# Altium project RodManipulator_PRJ.PrjPcb
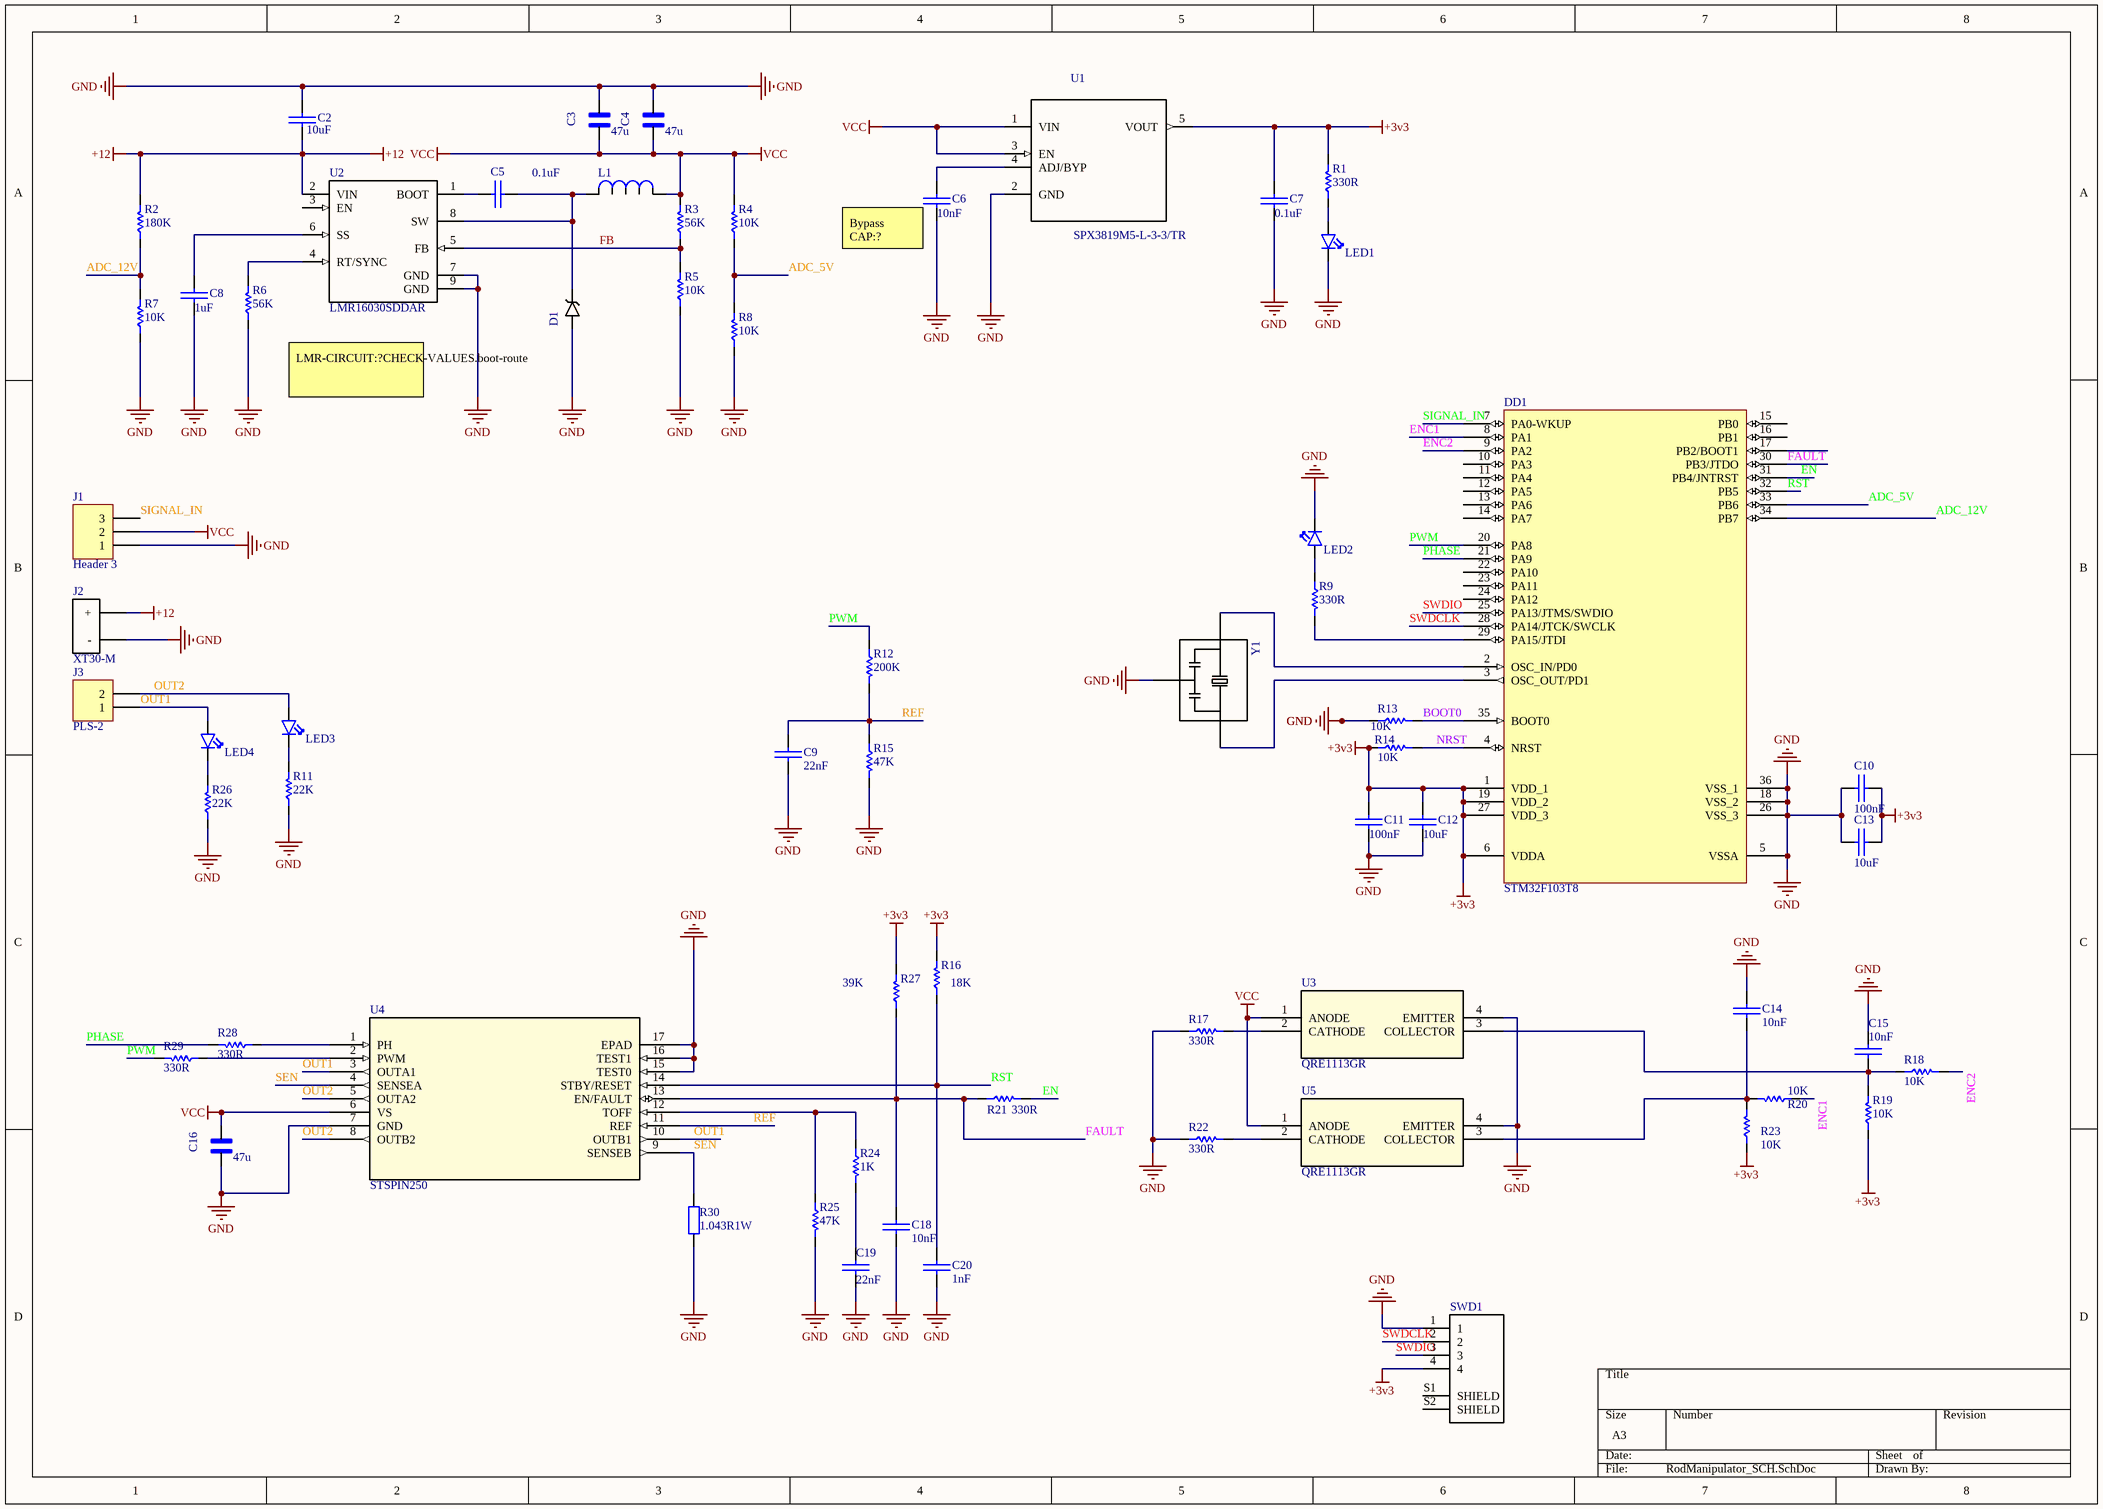
[diagram p0: RodManipulator_SCH.SchDoc]
1 sheet, 64 parts. Net scope: global (net labels, ports and power ports of the same name join across sheets).
Board file: RodManipulator_PCB.PcbDoc

## Sheet RodManipulator_SCH.SchDoc
size A3

### Parts
C2  10uF  [SMD_CAP_0603]
C3  value 47u  [*CAPC3216X125N]  (hidden comment: GRM31CR61A476KE15L)
C4  value 47u  [*CAPC3216X125N]  (hidden comment: GRM31CR61A476KE15L)
C5  0.1uF  [SMD_CAP_0603]
C6  10nF  [SMD_CAP_0603]
C7  0.1uF  [SMD_CAP_0603]
C8  1uF  [SMD_CAP_0603]
C9  22nF  [SMD_CAP_0603]
C10  100nF  [SMD_CAP_0603]
C11  100nF  [SMD_CAP_0603]
C12  10uF  [SMD_CAP_0603]
C13  10uF  [SMD_CAP_0603]
C14  10nF  [SMD_CAP_0603]
C15  10nF  [SMD_CAP_0603]
C16  value 47u  [*CAPC3216X125N]  (hidden comment: GRM31CR61A476KE15L)
C18  10nF  [SMD_CAP_0603]
C19  22nF  [SMD_CAP_0603]
C20  1nF  [SMD_CAP_0603]
D1  SK56  [*SMB_P6SMB62AT3G(Primary)]  (value not drawn)
DD1  STM32F103T8  [*QFN50P600X600X100-37N]
J1  Header 3  [HDR Side 3 pin]
J2  XT30-M  [XT30-M side]
J3  PLS-2  [HDR Side 2 pin]
L1  IHLP2020BZER100M01  [IHLP]  (value not drawn)
LED1  LED  [LED0603]  (value not drawn)
LED2  LED  [LED0603]  (value not drawn)
LED3  LED  [LED0603]  (value not drawn)
LED4  LED  [LED0603]  (value not drawn)
R1  330R  [RES 0603 (1608X06L)]
R2  180K  [RES 0603 (1608X06L)]
R3  56K  [RES 0603 (1608X06L)]
R4  10K  [RES 0603 (1608X06L)]
R5  10K  [RES 0603 (1608X06L)]
R6  56K  [RES 0603 (1608X06L)]
R7  10K  [RES 0603 (1608X06L)]
R8  10K  [RES 0603 (1608X06L)]
R9  330R  [RES 0603 (1608X06L)]
R11  22K  [RES 0603 (1608X06L)]
R12  200K  [RES 0603 (1608X06L)]
R13  10K  [RES 0603 (1608X06L)]
R14  10K  [RES 0603 (1608X06L)]
R15  47K  [RES 0603 (1608X06L)]
R16  18K  [RES 0603 (1608X06L)]
R17  330R  [RES 0603 (1608X06L)]
R18  10K  [RES 0603 (1608X06L)]
R19  10K  [RES 0603 (1608X06L)]
R20  10K  [RES 0603 (1608X06L)]
R21  330R  [RES 0603 (1608X06L)]
R22  330R  [RES 0603 (1608X06L)]
R23  10K  [RES 0603 (1608X06L)]
R24  1K  [RES 0603 (1608X06L)]
R25  47K  [RES 0603 (1608X06L)]
R26  22K  [RES 0603 (1608X06L)]
R27  39K  [RES 0603 (1608X06L)]
R28  330R  [RES 0603 (1608X06L)]
R29  330R  [RES 0603 (1608X06L)]
R30  value 1.043R1W  [RES2512]  (hidden comment: resistor)
SWD1  SM04B-GHS-TB(LF)(SN)-  [JST_BM04B-GHS-holes]  (value not drawn)
U1  SPX3819M5-L-3-3/TR  [*SOT95P280X145-5N]
U2  LMR16030SDDAR  [*SOIC127P600X170-9N - duplicate]
U3  QRE1113GR  [SMD4_2P90X3P60_ONS]
U4  STSPIN250  [VFQFPN-16]
U5  QRE1113GR  [SMD4_2P90X3P60_ONS]
Y1  CSTCE8M00G55-R0  [*OSC_CSTCE8M00G55-R0]  (value not drawn)

### Nets
+3v3: C7.2(-) C10.1(+) C11.1(+) C12.1(+) C13.1(+) DD1.1(VDD_1) DD1.6(VDDA) DD1.19(VDD_2) DD1.27(VDD_3) R1.2 R14.1 R16.2 R19.1 R23.1 R27.2 SWD1.4 U1.5(VOUT)
+12: C2.1(+) J2.PLUS(+) R2.2 U2.2(VIN)
GND: C2.2(-) C3.2 C4.2 C6.1(+) C7.1(+) C8.2(-) C9.1(+) C10.2(-) C11.2(-) C12.2(-) C13.2(-) C14.1(+) C15.1(+) C16.1 C18.1(+) C19.2(-) C20.1(+) D1.A DD1.5(VSSA) DD1.18(VSS_2) DD1.26(VSS_3) DD1.36(VSS_1) J1.1 J2.MINUS(-) LED1.2(K) LED2.2(K) R5.1 R6.1 R7.1 R8.1 R11.1 R13.1 R15.2 R17.1 R22.1 R25.2 R26.1 R30.1 SWD1.1 U1.2(GND) U2.7(GND) U2.9(GND) U3.4(EMITTER) U4.7(GND) U4.15(TEST0) U4.16(TEST1) U4.17(EPAD) U5.4(EMITTER) Y1.2
VCC: C3.1 C4.1 C16.2 J1.2 L1.1 R3.2 R4.2 U1.1(VIN) U1.3(EN) U3.1(ANODE) U4.6(VS) U5.1(ANODE)
ADC_5V: DD1.33(PB6) R4.1 R8.2
ADC_12V: DD1.34(PB7) R2.1 R7.2
BOOT0: DD1.35(BOOT0) R13.2
EN: DD1.31(PB4/JNTRST) R21.2
ENC1: DD1.8(PA1) R20.1
ENC2: DD1.9(PA2) R18.2
FAULT: C18.2(-) DD1.30(PB3/JTDO) R21.1 R27.1 U4.13(EN/FAULT)
FB: R3.1 R5.2 U2.5(FB)
NRST: DD1.4(NRST) R14.2
OUT1: J3.1 LED4.1(A) U4.3(OUTA1) U4.10(OUTB1)
OUT2: J3.2 LED3.1(A) U4.5(OUTA2) U4.8(OUTB2)
PHASE: DD1.21(PA9) R28.2
PWM: DD1.20(PA8) R12.1 R29.2
REF: C9.2(-) R12.2 R15.1 U4.11(REF)
RST: C20.2(-) DD1.32(PB5) R16.1 U4.14(STBY/RESET)
SEN: R30.2 U4.4(SENSEA) U4.9(SENSEB)
SIGNAL_IN: DD1.7(PA0-WKUP) J1.3
SWDCLK: DD1.28(PA14/JTCK/SWCLK) SWD1.2
SWDIO: DD1.25(PA13/JTMS/SWDIO) SWD1.3
NetC5_1: C5.1(+) D1.C L1.2 U2.8(SW)
NetC5_2: C5.2(-) U2.1(BOOT)
NetC6_2: C6.2(-) U1.4(ADJ/BYP)
NetC8_1: C8.1(+) U2.6(SS)
NetC14_2: C14.2(-) R20.2 R23.2 U5.3(COLLECTOR)
NetC15_2: C15.2(-) R18.1 R19.2 U3.3(COLLECTOR)
NetC19_1: C19.1(+) R24.2
NetDD1_2: DD1.2(OSC_IN/PD0) Y1.1
NetDD1_3: DD1.3(OSC_OUT/PD1) Y1.3
NetDD1_29: DD1.29(PA15/JTDI) R9.2
NetLED1_1: LED1.1(A) R1.1
NetLED2_1: LED2.1(A) R9.1
NetLED3_2: LED3.2(K) R11.2
NetLED4_2: LED4.2(K) R26.2
NetR6_2: R6.2 U2.4(RT/SYNC)
NetR17_2: R17.2 U3.2(CATHODE)
NetR22_2: R22.2 U5.2(CATHODE)
NetR24_1: R24.1 R25.1 U4.12(TOFF)
NetR28_1: R28.1 U4.1(PH)
NetR29_1: R29.1 U4.2(PWM)

Not connected (* = marked no-connect by the designer): DD1 10(PA3) 11(PA4) 12(PA5) 13(PA6) 14(PA7) 15(PB0) 16(PB1) 17(PB2/BOOT1) 22(PA10) 23(PA11) 24(PA12); SWD1 S1(SHIELD) S2(SHIELD); U2 3(EN)

### Notes on the sheet
- (near C6) Bypass CAP:?
- LMR-CIRCUIT:?CHECK-VALUES.boot-route

### Library data of the parts
C2 C5-C15 C18-C20 = Cap-Bipolar: Bipolar Capacitor; Voltage: 100V; Designer: Saeid Jorablo; Organazation: ControTec; Adding Date: 1387/12/20
  C2 C12 C13: Value: 10uF
  C5 C7: Value: 0.1uF
  C6 C14 C15 C18: Value: 10nF
  C8: Value: 1uF
  C9 C19: Value: 22nF
  C10 C11: Value: 100nF
  C20: Value: 1nF
C3 C4 C16 = GRM31CR61A476KE15L: Multilayer Ceramic Capacitor, GRM Series, 47 - F, - 10%, X5R, 10 V, 1206 [3216 Metric]; MF: Murata Electronics; Type: SMD; Package: 1206 Murata Electronics; MP: GRM31CR61A476KE15L; SnapEDA_Link: https://www.snapeda.com/parts/GRM31CR61A476KE15L/Murata%20Electronics%20North%20America/view-part/?ref=snap
D1 = SK56: Диод Шоттки 5А 60В [SMB / DO-214AA]; MF: Littelfuse Inc.; Type: SMD; MP: SK56; Package: DO-214 Littelfuse; SnapEDA_Link: https://www.snapeda.com/parts/P6SMB62AT3G/Littelfuse%20Inc./view-part/?ref=snap; Value: *; ChipDip_Link: https://www.chipdip.ru/product/sk56
DD1 = STM32F103T8: STM32F103T8U6, Микроконтроллер 32BIT ARM 64K FLASH [VFQFPN-36]; MF: STM; ChipDip_Link: https://www.chipdip.ru/product/stm32f103t8u6-2; HelpURL: http://www.st.com/stonline/products/literature/ds/13587.pdf; MP: STM32F103T8U6; Package: VFQFPN-36; SnapEDA_Link: https://www.snapeda.com/parts/STM32F103T8U6TR/STMicroelectronics/view-part/?ref=search&t=STM32F103T8U6; Type: SMD
J1 = Header 3: Header, 3-Pin; LatestRevisionDate: 17-Jul-2002; LatestRevisionNote: Re-released for DXP Platform.; Publisher: Altium Limited
J2 = XT30-M: MP: XT60-M; MF: AMASS; Package: Package Analog Devices; Availability: Unavailable; SnapEDA_Link: https://www.snapeda.com/parts/XT60-M/AMASS/view-part/?ref=snap; Price: None; Value: *
J3 = PLS-2: Header, 2-Pin; System: Connector; MF: Connfly electronic (Zhenqin); MP: PLS-3 (DS1021-1x3); Type: SMD; ChipDip_Link: https://www.chipdip.ru/product/pls-2; HelpURL: https://static.chipdip.ru/lib/227/DOC000227157.pdf
L1 = IHLP2020BZER100M01: 10µH Shielded Molded Inductor 2.3A 199mOhm Max Nonstandard; Value: 10uH; MF: Vishay Dale; Type: SMD; SnapEDA_Link: https://www.snapeda.com/parts/IHLP2020BZER100M01/Vishay%20Dale/view-part/44808/?ref=snap; MP: IHLP2020BZER100M01; Package: Nonstandard Vishay; HelpURL: http://www.vishay.com/docs/34253/ihlp-2020bz-01.pdf; ChipDip_Link: https://www.chipdip.ru/product/ihlp2020bzer100m11-inductor-ihlp-smd-2020-10
LED1-LED4 = LED: Designer :: Razi Research Team Of Mashhad - Hamed Jafarzadeh
R1-R9 R11-R29 = Resistor: Tolerance: 5%; Power: 1/8 W
  R1 R9 R17 R21 R22 R28 R29: Value: 330R
  R2: Value: 180K
  R3 R6: Value: 56K
  R4 R5 R7 R8 R13 R14 R18-R20 R23: Value: 10K
  R11 R26: Value: 22K
  R12: Value: 200K
  R15 R25: Value: 47K
  R16: Value: 18K
  R24: Value: 1K
  R27: Value: 39K
SWD1 = SWD SM04B-GHS-TB(LF)(SN)-: Conn Shrouded Header HDR 4 POS 1.25mm Solder ST SMD Reel; MF: JST Sales; Instructions: Do not install; System: Connector; SnapEDA_Link: https://www.snapeda.com/parts/BM04B-GHS-TBT%28LF%29%28SN%29%28N%29/JST%20Sales%20America%20Inc./view-part/?ref=snap; MP: SM04B-GHS-TB(LF)(SN); Package: None; Value: *; Type: SMD
U1 = SPX3819M5-L-3-3/TR: Low Dropout Voltage Regulator, Adjustable 0.5A, В±1%, 2.5 to 16 Vin, 5-Pin SOT-23 /; MF: MaxLinear, Inc.; Value: 3V3; MP: SPX3819M5-L-3-3/TR; Package: SOT-23-5 Exar; SnapEDA_Link: https://www.snapeda.com/parts/SPX3819M5-L/MaxLinear%2C%20Inc./view-part/?ref=snap; Type: SMD; ChipDip_Link: https://www.chipdip.ru/product1/8003455237; HelpURL: http://www.farnell.com/datasheets/2614478.pdf
U2 = LMR16030SDDAR: LMR16030SDDAR, Conv DC-DC 4.3V to 60V Step Down Single-Out 1V to 50V 3A Automotive 8-Pin HSOP EP T/R; MF: Texas Instruments; SnapEDA_Link: https://www.snapeda.com/parts/TPS54560DDA/Texas%20Instruments/view-part/?ref=snap; MP: LMR16030SDDAR; Package: PowerSOIC-8 Texas Instruments; Value: *; Type: SMD; ChipDip_Link: https://www.chipdip.ru/product1/8003448566; HelpURL: https://www.ti.com/lit/ds/symlink/lmr16030.pdf
U3 U5 = QRE1113GR: No Description Available; Vendor: ON Semiconductor; Built_By: Ehsan Shaghaei; SourceLibrary: ON_Semiconductor_2019-12-30; Manufacturer_Part_Number: QRE1113GR; Copyright: Copyright (C) 2018 Accelerated Designs. All rights reserved; RefDes: RefDes; Type: DEV; ComponentLink1Description: New link; ComponentLink1URL: *; ChipDip_Link: https://www.chipdip.ru/product/qre1113gr-fairchild
U4 = STSPIN250: No Description Available; Manufacturer_Part_Number: STSPIN220; Vendor: STMicroelectronics; Built_By: Ehsan Shaghaei; SourceLibrary: Update_to_database_2020-12-04; Copyright: Copyright (C) 2018 Accelerated Designs. All rights reserved; RefDes: RefDes; Type: DEV
Y1 = CSTCE8M00G55-R0: Ceramic Resonator 8MHz ??0.5% _Tol_ ??0.2% _Stability_ 33pF 40Ohm 3-Pin CSMD T/R; MF: Murata; MP: CSTCE8M00G55-R0; Package: SMD-3 Murata; SnapEDA_Link: https://www.snapeda.com/parts/CSTCE8M00G55-R0/Murata%20Electronics%20North%20America/view-part/?ref=snap; Value: *; ChipDip_Link: https://www.chipdip.ru/product1/8001783721; HelpURL: https://www.murata.com/en-eu/api/pdfdownloadapi?cate=&partno=CSTCE8M00G55-R0; Type: SMD
R30 = resistor: Published: 8-Jun-2000; LatestRevisionDate: 17-Jul-2002; LatestRevisionNote: Re-released for DXP Platform.; PackageReference: AXIAL-0.4; Publisher: Altium Limited